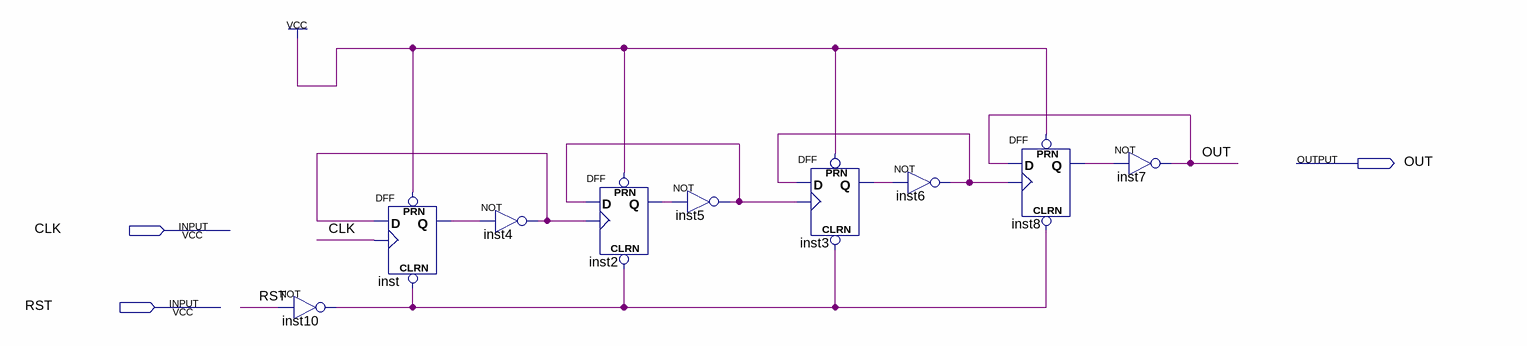
[diagram p0: schematic sheet]
// Quartus schematic DIVCLOCK.bdf as structural Verilog: 9 symbols, 3 pins
module DIVCLOCK (
  input  CLK,
  input  RST,
  output OUT
);

  wire inst2_q, inst3_q, inst4_out, inst5_out, inst6_out, inst8_q, inst10_out, inst_q;

  not inst10 (inst10_out, RST);
  DFF inst (.CLRN(inst10_out), .CLK(CLK), .D(inst4_out), .PRN(1'b1), .Q(inst_q));
  not inst4 (inst4_out, inst_q);
  DFF inst2 (.CLRN(inst10_out), .CLK(inst4_out), .D(inst5_out), .PRN(1'b1), .Q(inst2_q));
  not inst5 (inst5_out, inst2_q);
  DFF inst3 (.CLRN(inst10_out), .CLK(inst5_out), .D(inst6_out), .PRN(1'b1), .Q(inst3_q));
  not inst6 (inst6_out, inst3_q);
  DFF inst8 (.CLRN(inst10_out), .CLK(inst6_out), .D(OUT), .PRN(1'b1), .Q(inst8_q));
  not inst7 (OUT, inst8_q);
endmodule
